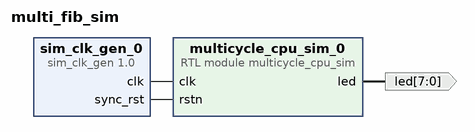
[diagram p0: block diagram of the top level]
# Vivado block design multi_fib_sim, xcku040-ffva1156-2-e, Vivado 2019.2.1
create_bd_design multi_fib_sim

create_bd_port -dir O -from 7 -to 0 -type data led

create_bd_cell -type ip -vlnv xilinx.com:ip:sim_clk_gen:1.0 sim_clk_gen_0
create_bd_cell -type module -reference multicycle_cpu_sim multicycle_cpu_sim_0

# ---- connections ----

connect_bd_net [get_bd_pins sim_clk_gen_0/clk] [get_bd_pins multicycle_cpu_sim_0/clk]
connect_bd_net [get_bd_pins sim_clk_gen_0/sync_rst] [get_bd_pins multicycle_cpu_sim_0/rstn]
connect_bd_net [get_bd_pins multicycle_cpu_sim_0/led] [get_bd_ports led]

validate_bd_design
save_bd_design
